# Altium project UMTK.PrjPCB
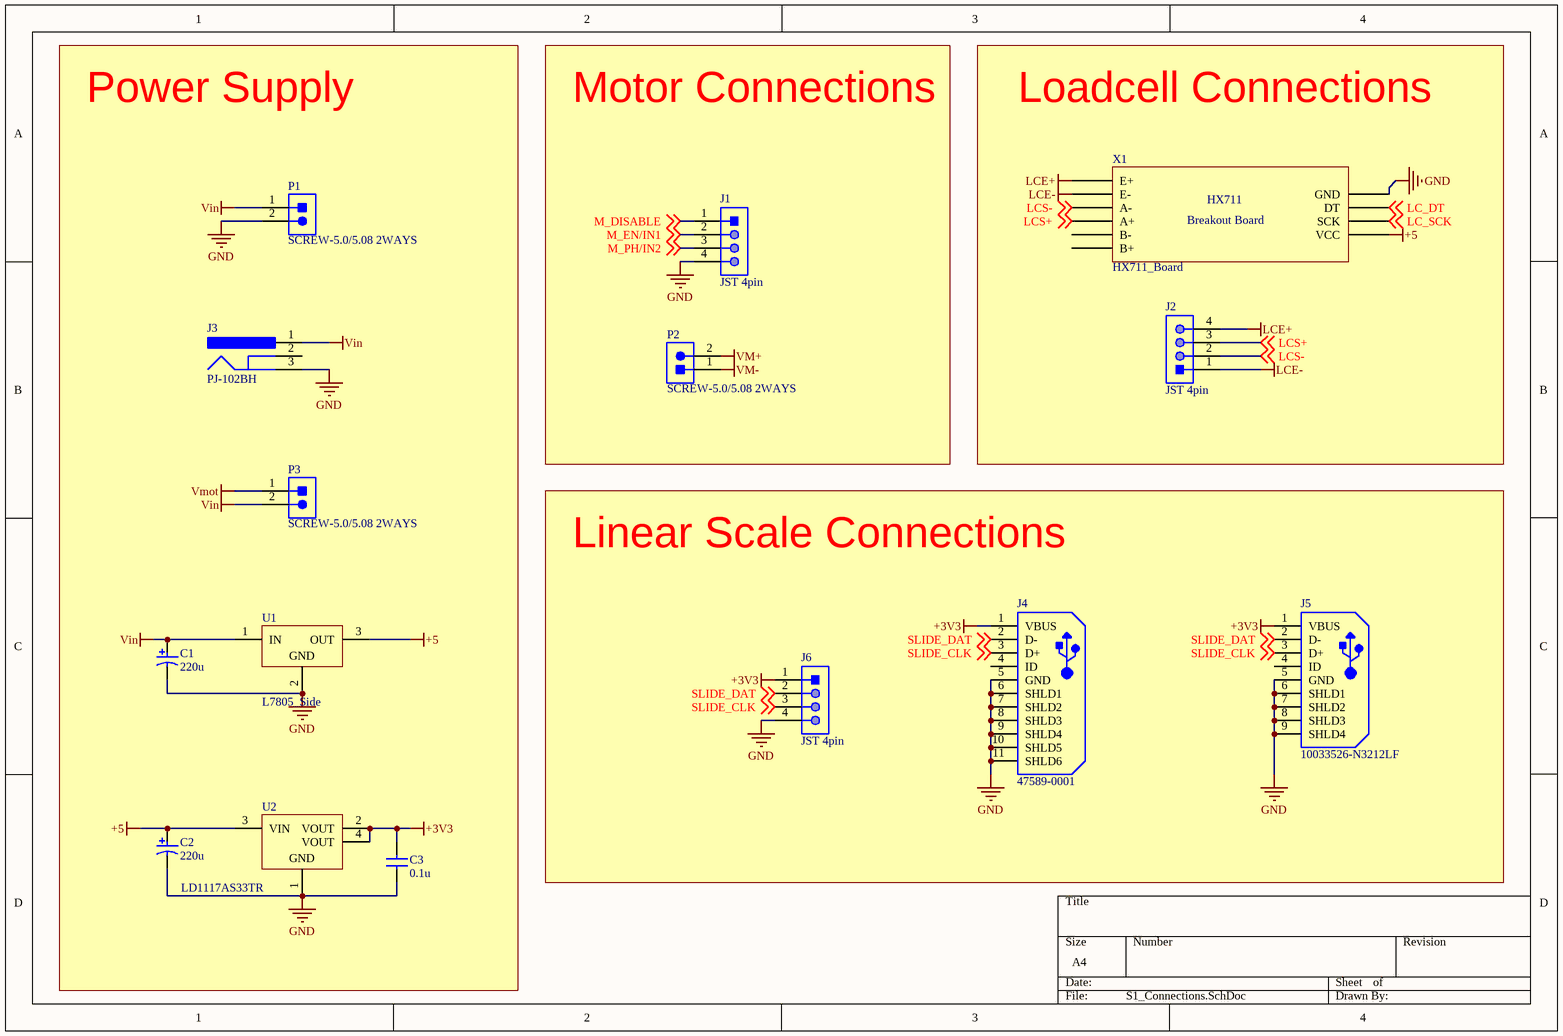
[diagram p0: S1_Connections.SchDoc]
4 sheets, 100 parts. Net scope: global (net labels, ports and power ports of the same name join across sheets).
Board file: UMTK.PcbDoc
Sheets:
  S1_Connections.SchDoc
  S3_Arduino.SchDoc
  S4_MotorDriver.SchDoc
  S2_UserInterface.SchDoc

## Sheet S1_Connections.SchDoc
size A4

### Parts
C1  220u  [Alu Cap 6.3x2.5mm]
C2  220u  [Alu Cap 6.3x2.5mm]
C3  0.1u  [Ceramic Cap 5mm]
J1  JST 4pin  [4Pin JST]
J2  JST 4pin  [4Pin JST]
J3  PJ-102BH  [CUI-PJ-102BH_V]
J4  47589-0001  [MOLX-47589-0001_V]
J5  10033526-N3212LF  [FCI-10033526-N3212LF_V]
J6  JST 4pin  [4Pin JST]
P1  SCREW-5.0/5.08 2WAYS  [SCREW-5.0-2WAYS_V]
P2  SCREW-5.0/5.08 2WAYS  [SCREW-5.0-2WAYS_V]
P3  SCREW-5.0/5.08 2WAYS  [SCREW-5.0-2WAYS_V]
U1  L7805_Side  [TO220_Side Mount]
U2  LD1117AS33TR  [SOT-223_M]
X1  HX711_Board  [HX711_Board_Large]

### Blocks framed on the sheet
Power Supply: C1-C3 J3 P1 P3 U1 U2
Motor Connections: J1 P2
Loadcell Connections: J2 X1
Linear Scale Connections: J4-J6

### Nets
+3V3: C3.1 J4.1(VBUS) J5.1(VBUS) J6.1 U2.2(VOUT) U2.4(VOUT)
+5: C2.1 U1.3(OUT) U2.3(VIN) X1.7(VCC)
GND: C1.2 C2.2 C3.2 J1.4 J3.3 J4.5(GND) J4.6(SHLD1) J4.7(SHLD2) J4.8(SHLD3) J4.9(SHLD4) J4.10(SHLD5) J4.11(SHLD6) J5.5(GND) J5.6(SHLD1) J5.7(SHLD2) J5.8(SHLD3) J5.9(SHLD4) J6.4 P1.2 U1.2(GND) U2.1(GND) X1.10(GND)
LCE+: J2.4 X1.1(E+)
LCE-: J2.1 X1.2(E-)
Vin: C1.1 J3.1 P1.1 P3.2 U1.1(IN)
VM+: P2.2
VM-: P2.1
Vmot: P3.1
LC_DT: X1.9(DT) ; off-sheet LC_DT
LC_SCK: X1.8(SCK) ; off-sheet LC_SCK
LCS+: J2.3 X1.4(A+) ; off-sheet LCS+
LCS-: J2.2 X1.3(A-) ; off-sheet LCS-
M_DISABLE: J1.1 ; off-sheet M_DISABLE
M_EN/IN1: J1.2 ; off-sheet M_EN/IN1
M_PH/IN2: J1.3 ; off-sheet M_PH/IN2
SLIDE_CLK: J4.3(D+) J5.3(D+) J6.3 ; off-sheet SLIDE_CLK
SLIDE_DAT: J4.2(D-) J5.2(D-) J6.2 ; off-sheet SLIDE_DAT

Not connected (* = marked no-connect by the designer): J3 2; J4 4(ID); J5 4(ID); X1 5(B-) 6(B+)

### Notes on the sheet
- (in symbol HX711_Board) HX711; Breakout Board

### Library data of the parts
C1 C2 = Polar Cap
C3 = Cap
J1 J2 J6 = 4Pin JST
J3 = CMP-2000-06901-1: Through Hole Right Angle DC Power Jack, 5 A, 2.5 mm Center Pin, 3 Position, -25 to 85 degC, RoHS, Bulk; Manufacturer: CUIInc.; Outside Contact Diameter: 6.5mm; Current Rating: 5A; Brand: CUI; Insulation Resistance: 100MOhms; Inside Contact Diameter: 2.5mm; Voltage Rating: 24V; Operating Temperature Range: -25Cto+85C; Mounting Angle: Right; Mounting Technology: ThroughHole; Product Category: DCPowerConnectors; Datasheet Version: Rev. 1.02, 05/2016; Connector Type: DCPowerJack; Contact Material: Copper; Housing Material: PolybutyleneTerephthalate(PBT); Mounting Style: ThroughHole; Product: Jacks; Package Reference: PJ-102BH; Manufacturer URL: http://www.cui.com/; RoHS: True; Contact Gender: Male; Contact Plating: Nickel; Flammability Rating: UL94V-0; Factory Pack Quantity: 280; Datasheet URL: http://www.cui.com/product/resource/pj-102bh.pdf; Package Description: 3-Pin Through Hole Device, Body 14.4 x 9 mm, Height 11 mm; Termination Style: ThroughHole
J4 = CMP-2000-05610-1: Right Angle Female Type AB Micro USB Connector, 30 V, 1.8 A, -30 to 85 degC, RoHS, Tape and Reel; Number of Ports: 1Port; Current Rating: 1.8A; Brand: Molex; Connector Type: MicroUSBTypeABreceptacle; Number of Contacts: 5Contact; Voltage Rating: 30VAC; Color: Black; Product: MicroUSBTypeABConnectors; Package URL: http://www.molex.com/pdm_docs/sd/475890001_sd.pdf; Contact Plating: Gold; Datasheet URL: http://www.molex.com/webdocs/datasheets/pdf/en-us/0475890001_IO_CONNECTORS.pdf; Operating Temperature Range: -20Cto+85C; Termination Style: SMD/SMT; Mounting Angle: Right; Package Reference: 47589-0001; Gender: Female; Package Description: Micro USB Connector, Pitch 0.65 mm, 5 Positions, Body 7.5 x 5.6 mm; Mounting Technology: SurfaceMount; Contact Material: CopperAlloy; Packaging: Reel; RoHS: True; Standard: USB; Manufacturer URL: http://www.molex.com/; Manufacturer: Molex; Datasheet Version: 12/2016; Product Category: USBConnectors; Series: 47589
J5 = CMP-1698-00001-2: Mini USB B-Type, 5-Pin SMD, RoHS, Tape and Reel; Manufacturer: FCI; Mounting Angle: Right; Number of Ports: 1 Port; Number of Contacts: 5 Contact; Connector Type: Mini USB Type B Receptacle; Gender: Female; Insulation Resistance: 100 MOhms; PartNumber: 10033526-N3212LF; DatasheetVersion: Rev. N; Termination Style: Solder Pad; Packaging: Reel; Shell Plating: Nickel; Standard: USB; Color: Black; ComponentLink1Description: Manufacturer URL; Mounting Technology: Surface Mount; Factory Pack Quantity: 750; Contact Material: Copper Alloy; Product Category: USB Connectors; ComponentLink2URL: http://portal.fciconnect.com/Comergent//fci/drawing/10033526.pdf; Flammability Rating: UL 94 V-0; Product: Mini USB Type B Connectors; Contact Plating: Gold; ComponentLink2Description: Datasheet; Brand: FCI; RoHS: Details; ComponentLink1URL: http://portal.fciconnect.com/; PackageDescription: 5-Pin Surface Mount Device, Body 9.2 x 7.7 mm, Pitch 0.8 mm
P1-P3 = CMP-0617-00009-1: Socket, Screw Terminal Block, 2 Way, 5.0 mm Pitch, 90 Degree Angle, Through-Hole; Manufacturer: No Vendor; Insulation Resistance: 5000 MOhm / 1000 V; Contact Resistance: 20 mOhm; Rated Current: 25 A; Poles: 2; Rated Voltage: 300 V; PartNumber: SCREW-5.0/5.08 2WAYS; ComponentLink1Description: Datasheet; ComponentLink1URL: 5mm screw terminal in SVN; Mounting Technology: Through Hole; PackageDescription: Socket, Screw Terminal Block, 2 Way, Pitch 5 mm, 90 Degree Angle, Through-Hole; Temperature Range: -40 to 105 degC
U2 = CMP-0244-00316-1: 1A, Low Drop Positive Voltage Regulator, 3.3V, 4-Pin SOT-223, Tape and Reel; ComponentLink1Description: Manufacturer URL; DatasheetVersion: 2/12/2011; PackageVersion: 2010; ComponentLink1URL: http://www.st.com; ComponentLink2Description: Datasheet; ComponentLink2URL: http://www.st.com/internet/com/TECHNICAL_RESOURCES/TECHNICAL_LITERATURE/DATASHEET/CD00002116.pdf; PackageDescription: 4-Pin SOT-223 Package, 6.5 x 3.5 mm Body, 2.3 mm Pitch, 7 mm Lead Span; PackageReference: SOT-223

## Sheet S3_Arduino.SchDoc
size A4
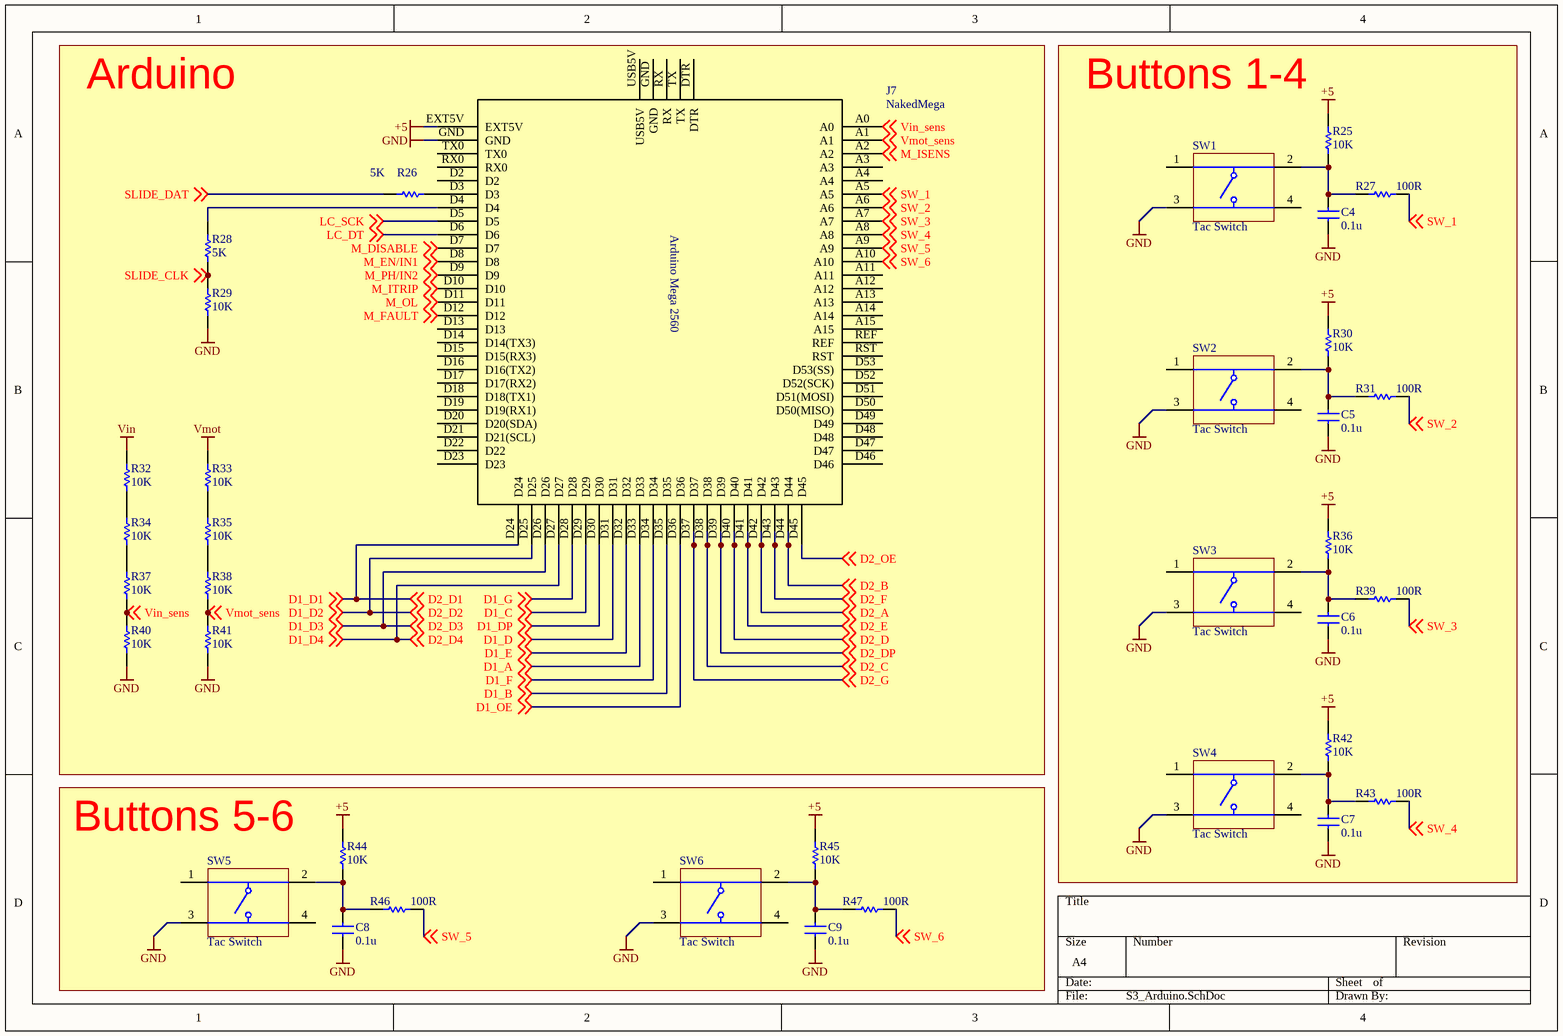
[diagram p1: S3_Arduino.SchDoc]

### Parts
C4  0.1u  [Ceramic Cap 5mm]
C5  0.1u  [Ceramic Cap 5mm]
C6  0.1u  [Ceramic Cap 5mm]
C7  0.1u  [Ceramic Cap 5mm]
C8  0.1u  [Ceramic Cap 5mm]
C9  0.1u  [Ceramic Cap 5mm]
J7  NakedMega  [Arduino Mega]
R25  value 10K  [AXIAL-0.3-3D]  (hidden comment: Res1)
R26  value 5K  [AXIAL-0.3-3D]  (hidden comment: Res1)
R27  value 100R  [AXIAL-0.3-3D]  (hidden comment: Res1)
R28  value 5K  [AXIAL-0.3-3D]  (hidden comment: Res1)
R29  value 10K  [AXIAL-0.3-3D]  (hidden comment: Res1)
R30  value 10K  [AXIAL-0.3-3D]  (hidden comment: Res1)
R31  value 100R  [AXIAL-0.3-3D]  (hidden comment: Res1)
R32  value 10K  [AXIAL-0.3-3D]  (hidden comment: Res1)
R33  value 10K  [AXIAL-0.3-3D]  (hidden comment: Res1)
R34  value 10K  [AXIAL-0.3-3D]  (hidden comment: Res1)
R35  value 10K  [AXIAL-0.3-3D]  (hidden comment: Res1)
R36  value 10K  [AXIAL-0.3-3D]  (hidden comment: Res1)
R37  value 10K  [AXIAL-0.3-3D]  (hidden comment: Res1)
R38  value 10K  [AXIAL-0.3-3D]  (hidden comment: Res1)
R39  value 100R  [AXIAL-0.3-3D]  (hidden comment: Res1)
R40  value 10K  [AXIAL-0.3-3D]  (hidden comment: Res1)
R41  value 10K  [AXIAL-0.3-3D]  (hidden comment: Res1)
R42  value 10K  [AXIAL-0.3-3D]  (hidden comment: Res1)
R43  value 100R  [AXIAL-0.3-3D]  (hidden comment: Res1)
R44  value 10K  [AXIAL-0.3-3D]  (hidden comment: Res1)
R45  value 10K  [AXIAL-0.3-3D]  (hidden comment: Res1)
R46  value 100R  [AXIAL-0.3-3D]  (hidden comment: Res1)
R47  value 100R  [AXIAL-0.3-3D]  (hidden comment: Res1)
SW1  Tac Switch  [TacSwitch]
SW2  Tac Switch  [TacSwitch]
SW3  Tac Switch  [TacSwitch]
SW4  Tac Switch  [TacSwitch]
SW5  Tac Switch  [TacSwitch]
SW6  Tac Switch  [TacSwitch]

### Blocks framed on the sheet
Arduino: J7 R26 R28 R29 R32-R35 R37 R38 R40 R41
Buttons 1-4: C4-C7 R25 R27 R30 R31 R36 R39 R42 R43 SW1-SW4
Buttons 5-6: C8 C9 R44-R47 SW5 SW6

### Nets
+5: J7.EXT5V R25.1 R30.1 R36.1 R42.1 R44.1 R45.1
GND: C4.2 C5.2 C6.2 C7.2 C8.2 C9.2 J7.GND R29.2 R40.2 R41.2 SW1.3 SW2.3 SW3.3 SW4.3 SW5.3 SW6.3
Vin: R32.1
Vmot: R33.1
D1_A: J7.D33 ; off-sheet D1_A
D1_B: J7.D35 ; off-sheet D1_B
D1_C: J7.D29 ; off-sheet D1_C
D1_D: J7.D31 ; off-sheet D1_D
D1_D1: J7.D24 ; off-sheet D1_D1, off-sheet D2_D1  [also labelled D2_D1]
D1_D2: J7.D25 ; off-sheet D1_D2, off-sheet D2_D2  [also labelled D2_D2]
D1_D3: J7.D26 ; off-sheet D1_D3, off-sheet D2_D3  [also labelled D2_D3]
D1_D4: J7.D27 ; off-sheet D1_D4, off-sheet D2_D4  [also labelled D2_D4]
D1_DP: J7.D30 ; off-sheet D1_DP
D1_E: J7.D32 ; off-sheet D1_E
D1_F: J7.D34 ; off-sheet D1_F
D1_G: J7.D28 ; off-sheet D1_G
D1_OE: J7.D36 ; off-sheet D1_OE
D2_A: J7.D42 ; off-sheet D2_A
D2_B: J7.D44 ; off-sheet D2_B
D2_C: J7.D38 ; off-sheet D2_C
D2_D: J7.D40 ; off-sheet D2_D
D2_DP: J7.D39 ; off-sheet D2_DP
D2_E: J7.D41 ; off-sheet D2_E
D2_F: J7.D43 ; off-sheet D2_F
D2_G: J7.D37 ; off-sheet D2_G
D2_OE: J7.D45 ; off-sheet D2_OE
LC_DT: J7.D6 ; off-sheet LC_DT
LC_SCK: J7.D5 ; off-sheet LC_SCK
M_DISABLE: J7.D7 ; off-sheet M_DISABLE
M_EN/IN1: J7.D8 ; off-sheet M_EN/IN1
M_FAULT: J7.D12 ; off-sheet M_FAULT
M_ISENS: J7.A2 ; off-sheet M_ISENS
M_ITRIP: J7.D10 ; off-sheet M_ITRIP
M_OL: J7.D11 ; off-sheet M_OL
M_PH/IN2: J7.D9 ; off-sheet M_PH/IN2
SLIDE_CLK: R28.2 R29.1 ; off-sheet SLIDE_CLK
SLIDE_DAT: R26.1 ; off-sheet SLIDE_DAT
SW_1: J7.A5 R27.2 ; off-sheet SW_1
SW_2: J7.A6 R31.2 ; off-sheet SW_2
SW_3: J7.A7 R39.2 ; off-sheet SW_3
SW_4: J7.A8 R43.2 ; off-sheet SW_4
SW_5: J7.A9 R46.2 ; off-sheet SW_5
SW_6: J7.A10 R47.2 ; off-sheet SW_6
Vin_sens: J7.A0 R37.2 R40.1 ; off-sheet Vin_sens
Vmot_sens: J7.A1 R38.2 R41.1 ; off-sheet Vmot_sens
NetC4_1: C4.1 R25.2 R27.1 SW1.2
NetC5_1: C5.1 R30.2 R31.1 SW2.2
NetC6_1: C6.1 R36.2 R39.1 SW3.2
NetC7_1: C7.1 R42.2 R43.1 SW4.2
NetC8_1: C8.1 R44.2 R46.1 SW5.2
NetC9_1: C9.1 R45.2 R47.1 SW6.2
NetJ7_D3: J7.D3 R26.2
NetJ7_D4: J7.D4 R28.1
NetR32_2: R32.2 R34.1
NetR33_2: R33.2 R35.1
NetR34_2: R34.2 R37.1
NetR35_2: R35.2 R38.1

Not connected (* = marked no-connect by the designer): J7 A3 A4 A11 A12 A13 A14 A15 D2 D13 D14(D14(TX3)) D15(D15(RX3)) D16(D16(TX2)) D17(D17(RX2)) D18(D18(TX1)) D19(D19(RX1)) D20(D20(SDA)) D21(D21(SCL)) D22 D23 D46 D47 D48 D49 D50(D50(MISO)) D51(D51(MOSI)) D52(D52(SCK)) D53(D53(SS)) DTR REF RST RX RX0 TX TX0 USB5V; SW1 1 4; SW2 1 4; SW3 1 4; SW4 1 4; SW5 1 4; SW6 1 4

### Notes on the sheet
- (in symbol NakedMega) Arduino Mega 2560

### Library data of the parts
C4-C9 = Cap
J7 = NakedMega: pin to pad: D2>2 D3>3 D4>4 D5>5 D6>6 D7>7 D8>8 D9>9 D10>10 D11>11 D12>12 D13>13 D14>14 D15>15 D16>16 D17>17 D18>18 D19>19 D20>20 D21>21 D22>22 D23>23 D24>24 D25>25 D26>26 D27>27 D28>28 D29>29 D30>30 D31>31 D32>32 D33>33 D34>34 D35>35 D36>36 D37>37 D38>38 D39>39 D40>40 D41>41 D42>42 D43>43 D44>44 D45>45 D46>46 D47>47 D48>48 D49>49 D50>50 D51>51 D52>52 D53>53 DTR>none EXT5V>5V RX>none RX0>1 TX>none TX0>0 USB5V>none
R25-R47 = Res1: Resistor; Published: 8-Jun-2000; LatestRevisionDate: 17-Jul-2002; LatestRevisionNote: Re-released for DXP Platform.; PackageReference: AXIAL-0.3; Publisher: Altium Limited; PackageDescription: Axial Device, Thru-Hole; 2 Leads; 0.3 in Pin Spacing

## Sheet S4_MotorDriver.SchDoc
size A4
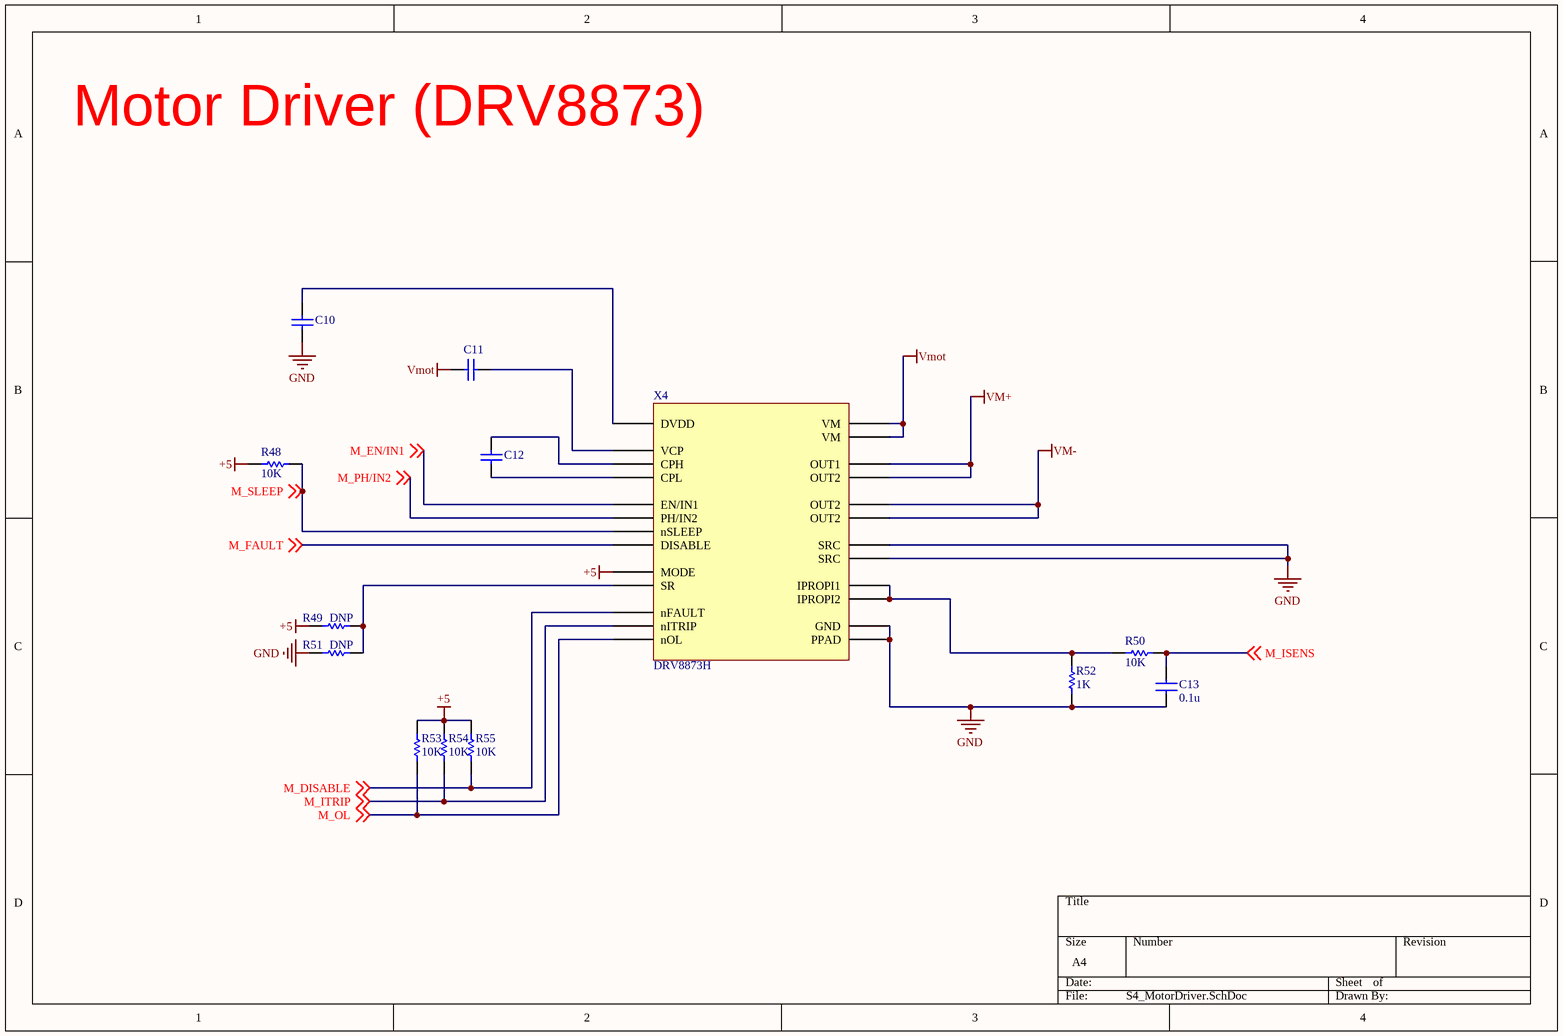
[diagram p2: S4_MotorDriver.SchDoc]

### Parts
C10  CAP 1uF 6.3V 1206(3216)  [CAPC1206(3216)130_M]  (value not drawn)
C11  CAP 1uF 25V 1206(3216)  [CAPC1206(3216)130_M]  (value not drawn)
C12  CAP 47nF 50V 1206(3216)  [CAPC1206(3216)130_L]  (value not drawn)
C13  0.1u  [Ceramic Cap 5mm]
R48  value 10K  [AXIAL-0.3-3D]  (hidden comment: Res1)
R49  value DNP  [AXIAL-0.3-3D]  (hidden comment: Res1)
R50  value 10K  [AXIAL-0.3-3D]  (hidden comment: Res1)
R51  value DNP  [AXIAL-0.3-3D]  (hidden comment: Res1)
R52  value 1K  [AXIAL-0.3-3D]  (hidden comment: Res1)
R53  value 10K  [AXIAL-0.3-3D]  (hidden comment: Res1)
R54  value 10K  [AXIAL-0.3-3D]  (hidden comment: Res1)
R55  value 10K  [AXIAL-0.3-3D]  (hidden comment: Res1)
X4  DRV8873H  [DRV8873]

### Nets
+5: R48.1 R49.2 R53.2 R54.2 R55.2 X4.3(MODE)
GND: C10.1 C13.2 R51.2 R52.2 X4.16(SRC) X4.17(SRC) X4.24(GND) X4.25(PPAD)
VM+: X4.18(OUT2) X4.19(OUT1)
VM-: X4.14(OUT2) X4.15(OUT2)
Vmot: C11.1 X4.13(VM) X4.20(VM)
M_DISABLE: R55.1 X4.2(nFAULT) ; off-sheet M_DISABLE
M_EN/IN1: X4.7(EN/IN1) ; off-sheet M_EN/IN1
M_FAULT: X4.9(DISABLE) ; off-sheet M_FAULT
M_ISENS: C13.1 R50.1 ; off-sheet M_ISENS
M_ITRIP: R54.1 X4.5(nITRIP) ; off-sheet M_ITRIP
M_OL: R53.1 X4.6(nOL) ; off-sheet M_OL
M_PH/IN2: X4.8(PH/IN2) ; off-sheet M_PH/IN2
M_SLEEP: R48.2 X4.11(nSLEEP) ; off-sheet M_SLEEP
NetC10_2: C10.2 X4.1(DVDD)
NetC11_2: C11.2 X4.21(VCP)
NetC12_1: C12.1 X4.23(CPL)
NetC12_2: C12.2 X4.22(CPH)
NetR49_1: R49.1 R51.1 X4.4(SR)
NetR50_2: R50.2 R52.1 X4.10(IPROPI1) X4.12(IPROPI2)

### Notes on the sheet
- Motor Driver (DRV8873)

### Library data of the parts
C10 = CMP-1037-04669-1: CAP 1uF 6.3V ±20% 1206 (3216 Metric) Thickness 1.2mm SMD; Tolerance: Â±20%; Case-Metric: 3216; Case-EIA: 1206; Max Thickness: 1.2 mm; Technology: SMT; Rated Voltage: 6.3 V; Value: 1uF
C11 = CMP-1037-04700-1: CAP 1uF 25V ±10% 1206 (3216 Metric) Thickness 1.3mm SMD; Tolerance: Â±10%; Case-Metric: 3216; Case-EIA: 1206; Value: 1uF; Rated Voltage: 25 V; Max Thickness: 1.3 mm; Technology: SMT
C12 = CMP-1037-03986-1: CAP 47nF 50V ±20% 1206 (3216 Metric) Thickness 1.2mm SMD; Case-EIA: 1206; Case-Metric: 3216; Tolerance: Â±20%; Technology: SMT; Max Thickness: 1.2 mm; Rated Voltage: 50 V; Value: 47nF
C13 = Cap
R48-R55 = Res1: Resistor; Published: 8-Jun-2000; LatestRevisionDate: 17-Jul-2002; LatestRevisionNote: Re-released for DXP Platform.; PackageReference: AXIAL-0.3; Publisher: Altium Limited; PackageDescription: Axial Device, Thru-Hole; 2 Leads; 0.3 in Pin Spacing
X4 = DRV8873: DRV8873-Q1 Automotive H-Bridge Motor Driver / This one is the H version, with Hbridge gate controls (no SPI)

## Sheet S2_UserInterface.SchDoc
size A4
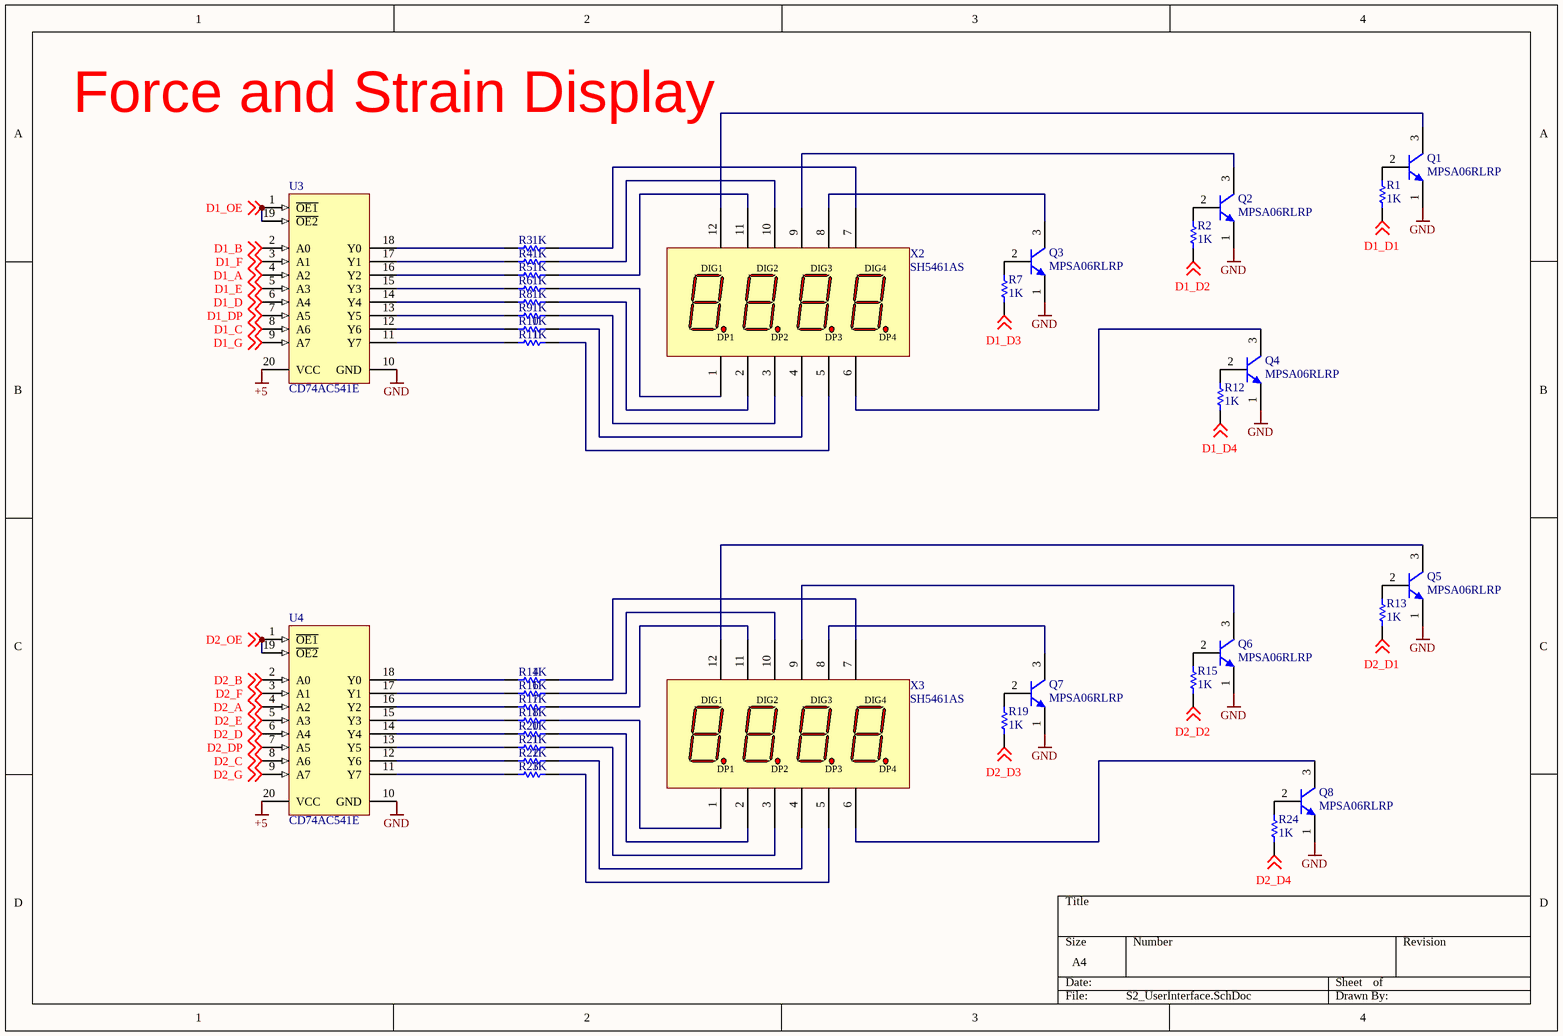
[diagram p3: S2_UserInterface.SchDoc]

### Parts
Q1  MPSA06RLRP  [ONSC-TO-92-3-29-11_AM_BL]
Q2  MPSA06RLRP  [ONSC-TO-92-3-29-11_AM_BL]
Q3  MPSA06RLRP  [ONSC-TO-92-3-29-11_AM_BL]
Q4  MPSA06RLRP  [ONSC-TO-92-3-29-11_AM_BL]
Q5  MPSA06RLRP  [ONSC-TO-92-3-29-11_AM_BL]
Q6  MPSA06RLRP  [ONSC-TO-92-3-29-11_AM_BL]
Q7  MPSA06RLRP  [ONSC-TO-92-3-29-11_AM_BL]
Q8  MPSA06RLRP  [ONSC-TO-92-3-29-11_AM_BL]
R1  value 1K  [AXIAL-0.3-3D]  (hidden comment: Res1)
R2  value 1K  [AXIAL-0.3-3D]  (hidden comment: Res1)
R3  value 1K  [AXIAL-0.3-3D]  (hidden comment: Res1)
R4  value 1K  [AXIAL-0.3-3D]  (hidden comment: Res1)
R5  value 1K  [AXIAL-0.3-3D]  (hidden comment: Res1)
R6  value 1K  [AXIAL-0.3-3D]  (hidden comment: Res1)
R7  value 1K  [AXIAL-0.3-3D]  (hidden comment: Res1)
R8  value 1K  [AXIAL-0.3-3D]  (hidden comment: Res1)
R9  value 1K  [AXIAL-0.3-3D]  (hidden comment: Res1)
R10  value 1K  [AXIAL-0.3-3D]  (hidden comment: Res1)
R11  value 1K  [AXIAL-0.3-3D]  (hidden comment: Res1)
R12  value 1K  [AXIAL-0.3-3D]  (hidden comment: Res1)
R13  value 1K  [AXIAL-0.3-3D]  (hidden comment: Res1)
R14  value 1K  [AXIAL-0.3-3D]  (hidden comment: Res1)
R15  value 1K  [AXIAL-0.3-3D]  (hidden comment: Res1)
R16  value 1K  [AXIAL-0.3-3D]  (hidden comment: Res1)
R17  value 1K  [AXIAL-0.3-3D]  (hidden comment: Res1)
R18  value 1K  [AXIAL-0.3-3D]  (hidden comment: Res1)
R19  value 1K  [AXIAL-0.3-3D]  (hidden comment: Res1)
R20  value 1K  [AXIAL-0.3-3D]  (hidden comment: Res1)
R21  value 1K  [AXIAL-0.3-3D]  (hidden comment: Res1)
R22  value 1K  [AXIAL-0.3-3D]  (hidden comment: Res1)
R23  value 1K  [AXIAL-0.3-3D]  (hidden comment: Res1)
R24  value 1K  [AXIAL-0.3-3D]  (hidden comment: Res1)
U3  CD74AC541E  [N0020A]
U4  CD74AC541E  [N0020A]
X2  SH5461AS  [4x7Seg]
X3  SH5461AS  [4x7Seg]

### Nets
+5: U3.20(VCC) U4.20(VCC)
GND: Q1.1(E) Q2.1(E) Q3.1(E) Q4.1(E) Q5.1(E) Q6.1(E) Q7.1(E) Q8.1(E) U3.10(GND) U4.10(GND)
D1_A: U3.4(A2) ; off-sheet D1_A
D1_B: U3.2(A0) ; off-sheet D1_B
D1_C: U3.8(A6) ; off-sheet D1_C
D1_D: U3.6(A4) ; off-sheet D1_D
D1_D1: R1.1 R13.1 ; off-sheet D1_D1, off-sheet D2_D1  [also labelled D2_D1]
D1_D2: R2.1 R15.1 ; off-sheet D1_D2, off-sheet D2_D2  [also labelled D2_D2]
D1_D3: R7.1 R19.1 ; off-sheet D1_D3, off-sheet D2_D3  [also labelled D2_D3]
D1_D4: R12.1 R24.1 ; off-sheet D1_D4, off-sheet D2_D4  [also labelled D2_D4]
D1_DP: U3.7(A5) ; off-sheet D1_DP
D1_E: U3.5(A3) ; off-sheet D1_E
D1_F: U3.3(A1) ; off-sheet D1_F
D1_G: U3.9(A7) ; off-sheet D1_G
D1_OE: U3.1(~{OE1}) U3.19(~{OE2}) ; off-sheet D1_OE
D2_A: U4.4(A2) ; off-sheet D2_A
D2_B: U4.2(A0) ; off-sheet D2_B
D2_C: U4.8(A6) ; off-sheet D2_C
D2_D: U4.6(A4) ; off-sheet D2_D
D2_DP: U4.7(A5) ; off-sheet D2_DP
D2_E: U4.5(A3) ; off-sheet D2_E
D2_F: U4.3(A1) ; off-sheet D2_F
D2_G: U4.9(A7) ; off-sheet D2_G
D2_OE: U4.1(~{OE1}) U4.19(~{OE2}) ; off-sheet D2_OE
NetQ1_2: Q1.2(B) R1.2
NetQ1_3: Q1.3(C) X2.12
NetQ2_2: Q2.2(B) R2.2
NetQ2_3: Q2.3(C) X2.9
NetQ3_2: Q3.2(B) R7.2
NetQ3_3: Q3.3(C) X2.8
NetQ4_2: Q4.2(B) R12.2
NetQ4_3: Q4.3(C) X2.6
NetQ5_2: Q5.2(B) R13.2
NetQ5_3: Q5.3(C) X3.12
NetQ6_2: Q6.2(B) R15.2
NetQ6_3: Q6.3(C) X3.9
NetQ7_2: Q7.2(B) R19.2
NetQ7_3: Q7.3(C) X3.8
NetQ8_2: Q8.2(B) R24.2
NetQ8_3: Q8.3(C) X3.6
NetR3_1: R3.1 X2.7
NetR3_2: R3.2 U3.18(Y0)
NetR4_1: R4.1 X2.10
NetR4_2: R4.2 U3.17(Y1)
NetR5_1: R5.1 X2.11
NetR5_2: R5.2 U3.16(Y2)
NetR6_1: R6.1 X2.1
NetR6_2: R6.2 U3.15(Y3)
NetR8_1: R8.1 X2.2
NetR8_2: R8.2 U3.14(Y4)
NetR9_1: R9.1 X2.3
NetR9_2: R9.2 U3.13(Y5)
NetR10_1: R10.1 X2.4
NetR10_2: R10.2 U3.12(Y6)
NetR11_1: R11.1 X2.5
NetR11_2: R11.2 U3.11(Y7)
NetR14_1: R14.1 X3.7
NetR14_2: R14.2 U4.18(Y0)
NetR16_1: R16.1 X3.10
NetR16_2: R16.2 U4.17(Y1)
NetR17_1: R17.1 X3.11
NetR17_2: R17.2 U4.16(Y2)
NetR18_1: R18.1 X3.1
NetR18_2: R18.2 U4.15(Y3)
NetR20_1: R20.1 X3.2
NetR20_2: R20.2 U4.14(Y4)
NetR21_1: R21.1 X3.3
NetR21_2: R21.2 U4.13(Y5)
NetR22_1: R22.1 X3.4
NetR22_2: R22.2 U4.12(Y6)
NetR23_1: R23.1 X3.5
NetR23_2: R23.2 U4.11(Y7)

### Notes on the sheet
- Force and Strain Display
- (in symbol 4x7Seg) DIG1; DIG2; DIG3; DIG4; DP1; DP2; DP3; DP4

### Library data of the parts
Q1-Q8 = CMP-1048-01505-1: 80 V, 0.5 A, Amplifier Transistor, NPN Transistor, 3-Pin TO-92, Ammo Box; Manufacturer: On Semiconductor; fT Min (MHz): 100; IC Continuous (A): 0.5; Note1: 0; ComponentLink3Description: Package Specification; PackageDescription: 3-Pin Transistor Outline, Body 4.825 x 3.685 mm, Pitch 1.27 mm; DatasheetVersion: Rev. 3; Polarity: NPN; Packing: Ammo Box; PartNumber: MPSA06RLRP; PackageVersion: Rev. AM; ComponentLink2URL: http://www.onsemi.cn/pub_link/Collateral/MPSA05-D.PDF; PackageReference: TO-92-3-29-11_AM_BL; ComponentLink2Description: Datasheet; Mounting Technology: Through Hole; ComponentLink1URL: http://www.onsemi.com/; ComponentLink3URL: http://www.onsemi.com/pub_link/Collateral/MAC97-D.PDF; ComponentLink1Description: Manufacturer URL; RoHS: FALSE
R1-R24 = Res1: Resistor; Published: 8-Jun-2000; LatestRevisionDate: 17-Jul-2002; LatestRevisionNote: Re-released for DXP Platform.; PackageReference: AXIAL-0.3; Publisher: Altium Limited; PackageDescription: Axial Device, Thru-Hole; 2 Leads; 0.3 in Pin Spacing
U3 U4 = CMP-0440-00981-2: Non-Inverting Octal Buffer/Line Drivers with 3-State Outputs, N0020A, TUBE; Manufacturer: Texas Instruments; F @ Nom Voltage(Max)(Mhz): 60; ICC @ Nom Voltage(Max)(mA): 0.16; VCC(Max)(V): 5.5; Rating: Catalog; Voltage(Nom)(V): 1.5,3.3,5; VCC(Min)(V): 1.5; tpd @ Nom Voltage(Max)(ns): 77,8.6,6.2; Output Type: CMOS; Bits(#): 8; Operating Temperature Range(C): -55 to 125; ComponentLink1Description: Manufacturer URL; DatasheetVersion: SCHS285A; Code_JEITA: 5.08; PackageReference: N0020A; ComponentLink2URL: http://www.ti.com/lit/ds/symlink/cd74ac541.pdf; PartNumber: CD74AC541E; ComponentLink2Description: Datasheet; PackageVersion: http://www.ti.com/lit/ml/mpdi002c/mpdi002c.pdf; Generic Part Number: CD74AC541; Input Type: CMOS; Code_IPC: MS-001; ComponentLink1URL: http://www.ti.com/
X2 X3 = 4x7Seg: 4 Character 7 Segment Display, Common Cathode

## Nets that join several sheets
+5: S1_Connections (C2.1 U1.3 U2.3 X1.7), S3_Arduino (7 pins), S4_MotorDriver (6 pins), S2_UserInterface (U3.20 U4.20)
GND: S1_Connections (22 pins), S3_Arduino (16 pins), S4_MotorDriver (8 pins), S2_UserInterface (10 pins)
Vin: S1_Connections (5 pins), S3_Arduino (R32.1)
VM+: S1_Connections (P2.2), S4_MotorDriver (X4.18 X4.19)
VM-: S1_Connections (P2.1), S4_MotorDriver (X4.14 X4.15)
Vmot: S1_Connections (P3.1), S3_Arduino (R33.1), S4_MotorDriver (C11.1 X4.13 X4.20)
D1_A: S3_Arduino (J7.D33), S2_UserInterface (U3.4)
D1_B: S3_Arduino (J7.D35), S2_UserInterface (U3.2)
D1_C: S3_Arduino (J7.D29), S2_UserInterface (U3.8)
D1_D: S3_Arduino (J7.D31), S2_UserInterface (U3.6)
D1_D1: S3_Arduino (J7.D24), S2_UserInterface (R1.1 R13.1)
D1_D2: S3_Arduino (J7.D25), S2_UserInterface (R2.1 R15.1)
D1_D3: S3_Arduino (J7.D26), S2_UserInterface (R7.1 R19.1)
D1_D4: S3_Arduino (J7.D27), S2_UserInterface (R12.1 R24.1)
D1_DP: S3_Arduino (J7.D30), S2_UserInterface (U3.7)
D1_E: S3_Arduino (J7.D32), S2_UserInterface (U3.5)
D1_F: S3_Arduino (J7.D34), S2_UserInterface (U3.3)
D1_G: S3_Arduino (J7.D28), S2_UserInterface (U3.9)
D1_OE: S3_Arduino (J7.D36), S2_UserInterface (U3.1 U3.19)
D2_A: S3_Arduino (J7.D42), S2_UserInterface (U4.4)
D2_B: S3_Arduino (J7.D44), S2_UserInterface (U4.2)
D2_C: S3_Arduino (J7.D38), S2_UserInterface (U4.8)
D2_D: S3_Arduino (J7.D40), S2_UserInterface (U4.6)
D2_DP: S3_Arduino (J7.D39), S2_UserInterface (U4.7)
D2_E: S3_Arduino (J7.D41), S2_UserInterface (U4.5)
D2_F: S3_Arduino (J7.D43), S2_UserInterface (U4.3)
D2_G: S3_Arduino (J7.D37), S2_UserInterface (U4.9)
D2_OE: S3_Arduino (J7.D45), S2_UserInterface (U4.1 U4.19)
LC_DT: S1_Connections (X1.9), S3_Arduino (J7.D6)
LC_SCK: S1_Connections (X1.8), S3_Arduino (J7.D5)
M_DISABLE: S1_Connections (J1.1), S3_Arduino (J7.D7), S4_MotorDriver (R55.1 X4.2)
M_EN/IN1: S1_Connections (J1.2), S3_Arduino (J7.D8), S4_MotorDriver (X4.7)
M_FAULT: S3_Arduino (J7.D12), S4_MotorDriver (X4.9)
M_ISENS: S3_Arduino (J7.A2), S4_MotorDriver (C13.1 R50.1)
M_ITRIP: S3_Arduino (J7.D10), S4_MotorDriver (R54.1 X4.5)
M_OL: S3_Arduino (J7.D11), S4_MotorDriver (R53.1 X4.6)
M_PH/IN2: S1_Connections (J1.3), S3_Arduino (J7.D9), S4_MotorDriver (X4.8)
SLIDE_CLK: S1_Connections (J4.3 J5.3 J6.3), S3_Arduino (R28.2 R29.1)
SLIDE_DAT: S1_Connections (J4.2 J5.2 J6.2), S3_Arduino (R26.1)

## Assembly variants
Default: all parts fitted